# Altium project neige_mega_shield.PrjPcb
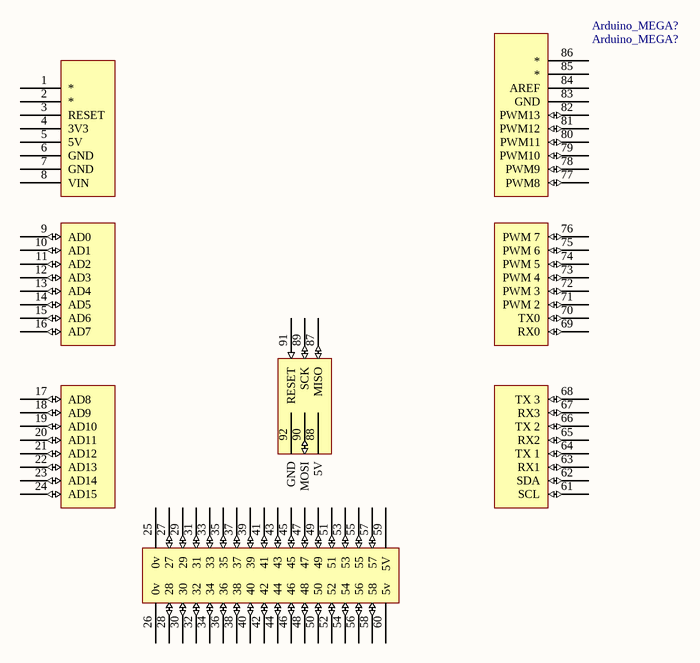
[diagram p0: neigeMegaShield.SchDoc]
3 sheets, 65 parts. Net scope: global (net labels, ports and power ports of the same name join across sheets).
Board file: neigeMegaShield.PcbDoc
Sheets:
  neigeMegaShield.SchDoc
  ampli1.SchDoc
  ampli2.SchDoc

## Sheet neigeMegaShield.SchDoc
size A4

### Parts
Arduino_MEGA?  Arduino_MEGA?  [ArduinoMEGA_ALL]

### Nets

Not connected (* = marked no-connect by the designer): Arduino_MEGA? 1(*) 2(*) 3(RESET) 4(3V3) 5(5V) 6(GND) 7(GND) 8(VIN) 9(AD0) 10(AD1) 11(AD2) 12(AD3) 13(AD4) 14(AD5) 15(AD6) 16(AD7) 17(AD8) 18(AD9) 19(AD10) 20(AD11) 21(AD12) 22(AD13) 23(AD14) 24(AD15) 25(0v) 26(0v) 27 28 29 30 31 32 33 34 35 36 37 38 39 40 41 42 43 44 45 46 47 48 49 50 51 52 53 54 55 56 57 58 59(5V) 60(5v) 61(SCL) 62(SDA) 63(RX1) 64(TX_1) 65(RX2) 66(TX_2) 67(RX3) 68(TX_3) 69(RX0) 70(TX0) 71(PWM_2) 72(PWM_3) 73(PWM_4) 74(PWM_5) 75(PWM_6) 76(PWM_7) 77(PWM8) 78(PWM9) 79(PWM10) 80(PWM11) 81(PWM12) 82(PWM13) 83(GND) 84(AREF) 85(*) 86(*) 87(MISO) 88(5V) 89(SCK) 90(MOSI) 91(RESET) 92(GND)

### Library data of the parts
Arduino_MEGA? = Arduino_MEGA

## Sheet ampli1.SchDoc
size B
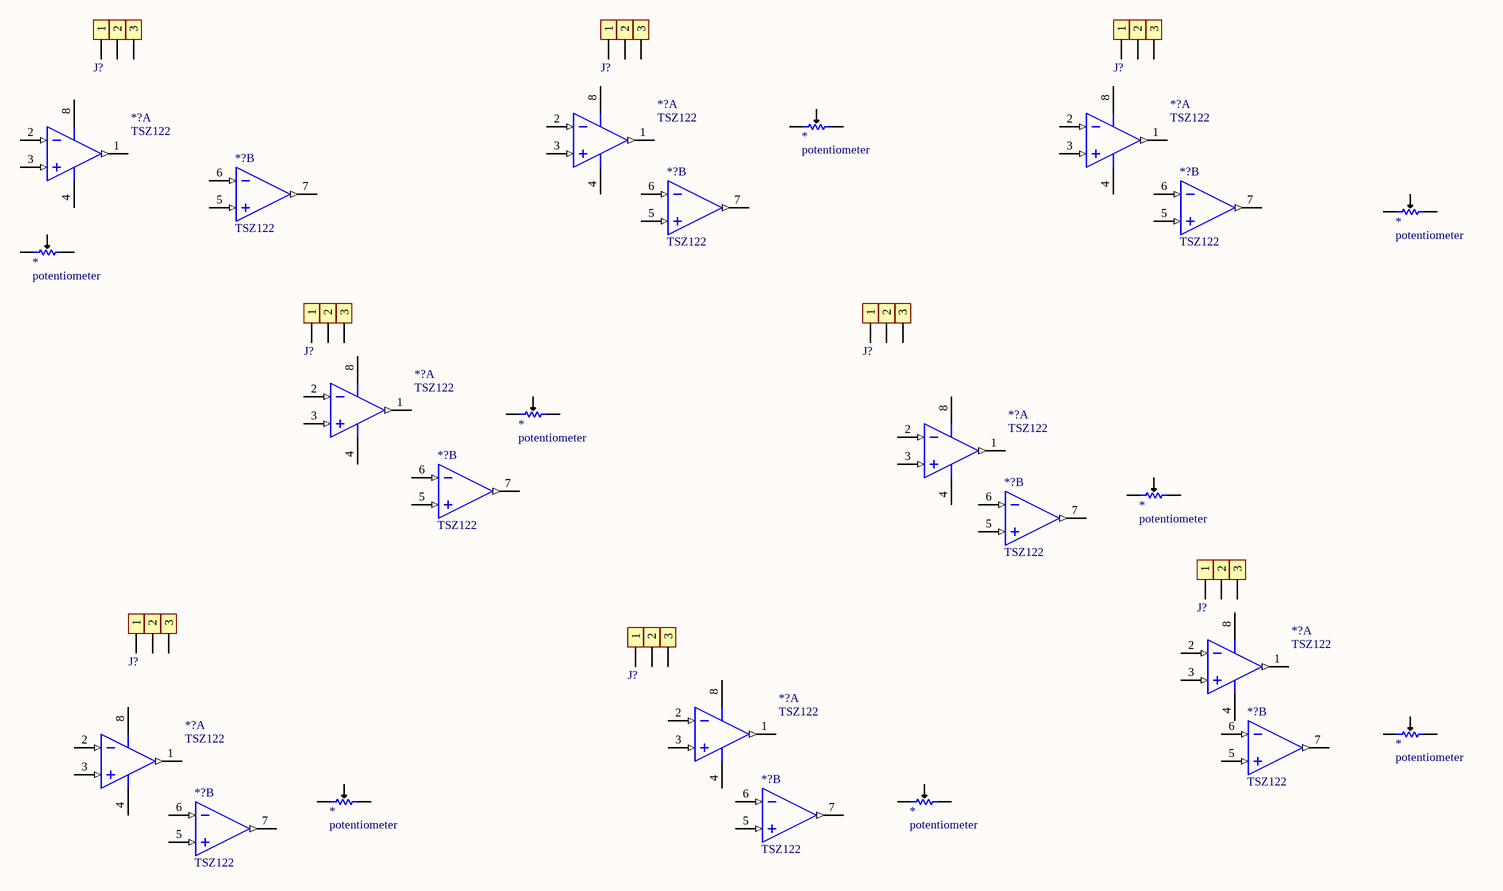
[diagram p1: ampli1.SchDoc]

### Parts
(Parts that share a designator on the sheet are numbered #1, #2 ... from top to bottom, then left to right.)
*#1  potentiometer  [POT_CT6EP500]
*#2  potentiometer  [POT_CT6EP500]
*#3  potentiometer  [POT_CT6EP500]
*#4  potentiometer  [POT_CT6EP500]
*#5  potentiometer  [POT_CT6EP500]
*#6  potentiometer  [POT_CT6EP500]
*#7  potentiometer  [POT_CT6EP500]
*#8  potentiometer  [POT_CT6EP500]
*?#1  TSZ122  [SO8]  (part A of 2)
*?#2  TSZ122  [SO8]  (part A of 2)
*?#3  TSZ122  [SO8]  (part A of 2)
*?#4  TSZ122  [SO8]  (part B of 2)
*?#5  TSZ122  [SO8]  (part B of 2)
*?#6  TSZ122  [SO8]  (part B of 2)
*?#7  TSZ122  [SO8]  (part A of 2)
*?#8  TSZ122  [SO8]  (part A of 2)
*?#9  TSZ122  [SO8]  (part B of 2)
*?#10  TSZ122  [SO8]  (part B of 2)
*?#11  TSZ122  [SO8]  (part A of 2)
*?#12  TSZ122  [SO8]  (part A of 2)
*?#13  TSZ122  [SO8]  (part B of 2)
*?#14  TSZ122  [SO8]  (part A of 2)
*?#15  TSZ122  [SO8]  (part B of 2)
*?#16  TSZ122  [SO8]  (part B of 2)
J?#1  1x3 CONNECTION  (value not drawn)
J?#2  1x3 CONNECTION  (value not drawn)
J?#3  1x3 CONNECTION  (value not drawn)
J?#4  1x3 CONNECTION  (value not drawn)
J?#5  1x3 CONNECTION  (value not drawn)
J?#6  1x3 CONNECTION  (value not drawn)
J?#7  1x3 CONNECTION  (value not drawn)
J?#8  1x3 CONNECTION  (value not drawn)

### Nets

Not connected (* = marked no-connect by the designer): *#1 1 2(1) 3(1); *#2 1 2(1) 3(1); *#3 1 2(1) 3(1); *#4 1 2(1) 3(1); *#5 1 2(1) 3(1); *#6 1 2(1) 3(1); *#7 1 2(1) 3(1); *#8 1 2(1) 3(1); *?#1 1(OUTA) 2(INA-) 3(INA+) 4(V-) 8(V+); *?#2 1(OUTA) 2(INA-) 3(INA+) 4(V-) 8(V+); *?#3 1(OUTA) 2(INA-) 3(INA+) 4(V-) 8(V+); *?#4 5(INA+) 6(INA-) 7(OUTA); *?#5 5(INA+) 6(INA-) 7(OUTA); *?#6 5(INA+) 6(INA-) 7(OUTA); *?#7 1(OUTA) 2(INA-) 3(INA+) 4(V-) 8(V+); *?#8 1(OUTA) 2(INA-) 3(INA+) 4(V-) 8(V+); *?#9 5(INA+) 6(INA-) 7(OUTA); *?#10 5(INA+) 6(INA-) 7(OUTA); *?#11 1(OUTA) 2(INA-) 3(INA+) 4(V-) 8(V+); *?#12 1(OUTA) 2(INA-) 3(INA+) 4(V-) 8(V+); *?#13 5(INA+) 6(INA-) 7(OUTA); *?#14 1(OUTA) 2(INA-) 3(INA+) 4(V-) 8(V+); *?#15 5(INA+) 6(INA-) 7(OUTA); *?#16 5(INA+) 6(INA-) 7(OUTA); J?#1 1 2 3; J?#2 1 2 3; J?#3 1 2 3; J?#4 1 2 3; J?#5 1 2 3; J?#6 1 2 3; J?#7 1 2 3; J?#8 1 2 3

### Library data of the parts
J?#1-J?#8 = 1x3 CONNECTION: 1x3 connection, pitch2.54mm, hole 1mm; pitch: 2.54mm; hole: 1mm

## Sheet ampli2.SchDoc
size B
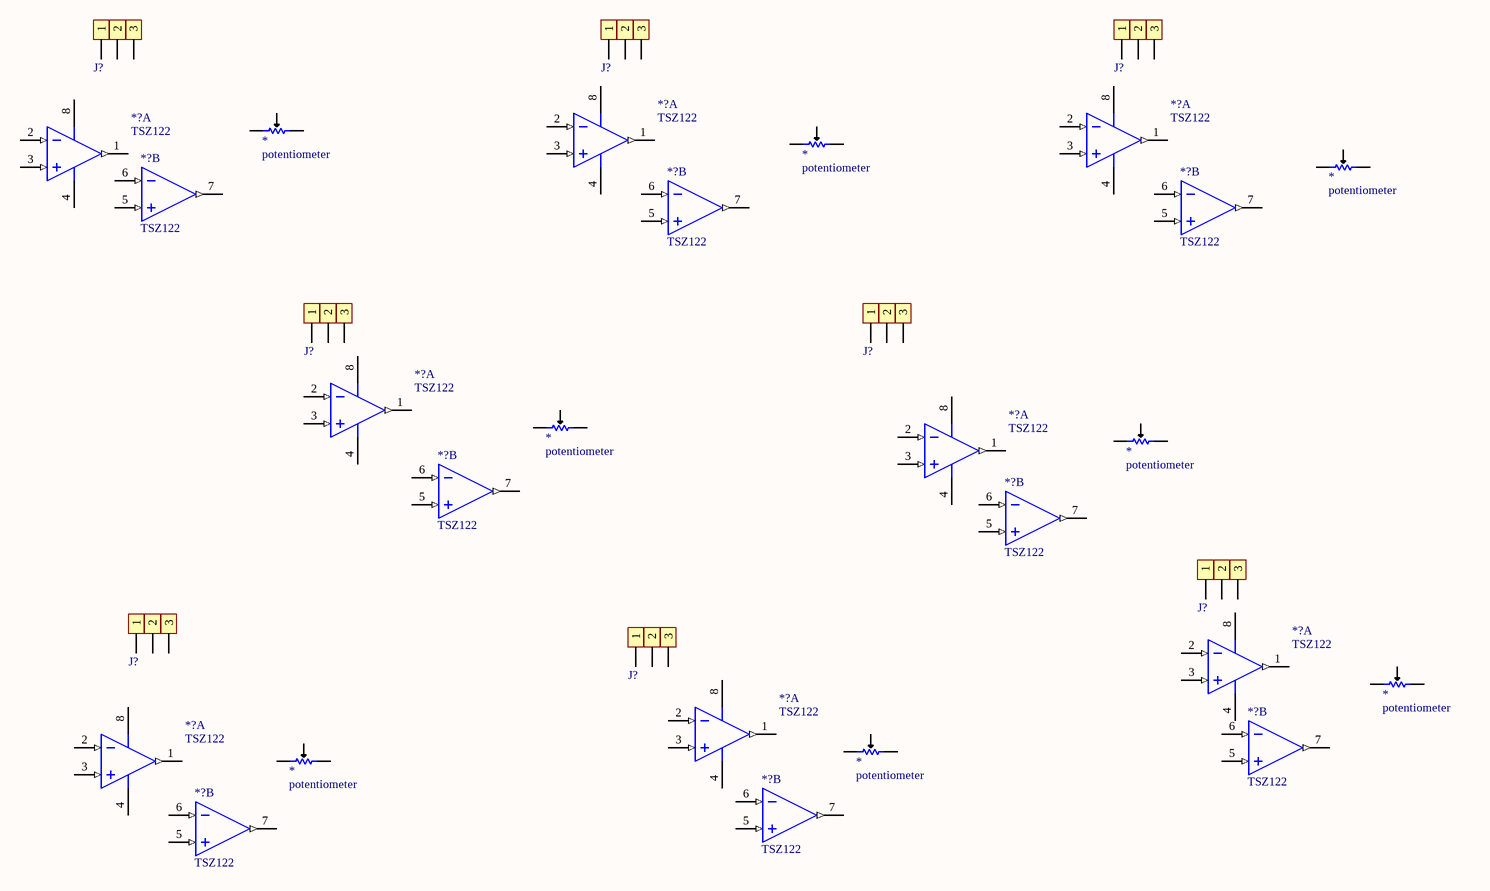
[diagram p2: ampli2.SchDoc]

### Parts
(Parts that share a designator on the sheet are numbered #1, #2 ... from top to bottom, then left to right.)
*#9  potentiometer  [POT_CT6EP500]
*#10  potentiometer  [POT_CT6EP500]
*#11  potentiometer  [POT_CT6EP500]
*#12  potentiometer  [POT_CT6EP500]
*#13  potentiometer  [POT_CT6EP500]
*#14  potentiometer  [POT_CT6EP500]
*#15  potentiometer  [POT_CT6EP500]
*#16  potentiometer  [POT_CT6EP500]
*?#17  TSZ122  [SO8]  (part A of 2)
*?#18  TSZ122  [SO8]  (part A of 2)
*?#19  TSZ122  [SO8]  (part A of 2)
*?#20  TSZ122  [SO8]  (part B of 2)
*?#21  TSZ122  [SO8]  (part B of 2)
*?#22  TSZ122  [SO8]  (part B of 2)
*?#23  TSZ122  [SO8]  (part A of 2)
*?#24  TSZ122  [SO8]  (part A of 2)
*?#25  TSZ122  [SO8]  (part B of 2)
*?#26  TSZ122  [SO8]  (part B of 2)
*?#27  TSZ122  [SO8]  (part A of 2)
*?#28  TSZ122  [SO8]  (part A of 2)
*?#29  TSZ122  [SO8]  (part B of 2)
*?#30  TSZ122  [SO8]  (part A of 2)
*?#31  TSZ122  [SO8]  (part B of 2)
*?#32  TSZ122  [SO8]  (part B of 2)
J?#9  1x3 CONNECTION  (value not drawn)
J?#10  1x3 CONNECTION  (value not drawn)
J?#11  1x3 CONNECTION  (value not drawn)
J?#12  1x3 CONNECTION  (value not drawn)
J?#13  1x3 CONNECTION  (value not drawn)
J?#14  1x3 CONNECTION  (value not drawn)
J?#15  1x3 CONNECTION  (value not drawn)
J?#16  1x3 CONNECTION  (value not drawn)

### Nets

Not connected (* = marked no-connect by the designer): *#9 1 2(1) 3(1); *#10 1 2(1) 3(1); *#11 1 2(1) 3(1); *#12 1 2(1) 3(1); *#13 1 2(1) 3(1); *#14 1 2(1) 3(1); *#15 1 2(1) 3(1); *#16 1 2(1) 3(1); *?#17 1(OUTA) 2(INA-) 3(INA+) 4(V-) 8(V+); *?#18 1(OUTA) 2(INA-) 3(INA+) 4(V-) 8(V+); *?#19 1(OUTA) 2(INA-) 3(INA+) 4(V-) 8(V+); *?#20 5(INA+) 6(INA-) 7(OUTA); *?#21 5(INA+) 6(INA-) 7(OUTA); *?#22 5(INA+) 6(INA-) 7(OUTA); *?#23 1(OUTA) 2(INA-) 3(INA+) 4(V-) 8(V+); *?#24 1(OUTA) 2(INA-) 3(INA+) 4(V-) 8(V+); *?#25 5(INA+) 6(INA-) 7(OUTA); *?#26 5(INA+) 6(INA-) 7(OUTA); *?#27 1(OUTA) 2(INA-) 3(INA+) 4(V-) 8(V+); *?#28 1(OUTA) 2(INA-) 3(INA+) 4(V-) 8(V+); *?#29 5(INA+) 6(INA-) 7(OUTA); *?#30 1(OUTA) 2(INA-) 3(INA+) 4(V-) 8(V+); *?#31 5(INA+) 6(INA-) 7(OUTA); *?#32 5(INA+) 6(INA-) 7(OUTA); J?#9 1 2 3; J?#10 1 2 3; J?#11 1 2 3; J?#12 1 2 3; J?#13 1 2 3; J?#14 1 2 3; J?#15 1 2 3; J?#16 1 2 3

### Library data of the parts
J?#9-J?#16 = 1x3 CONNECTION: as J?#1 on sheet ampli1; hole: 1mm